# EAGLE design in3peltier (EAGLE 7.1.0)
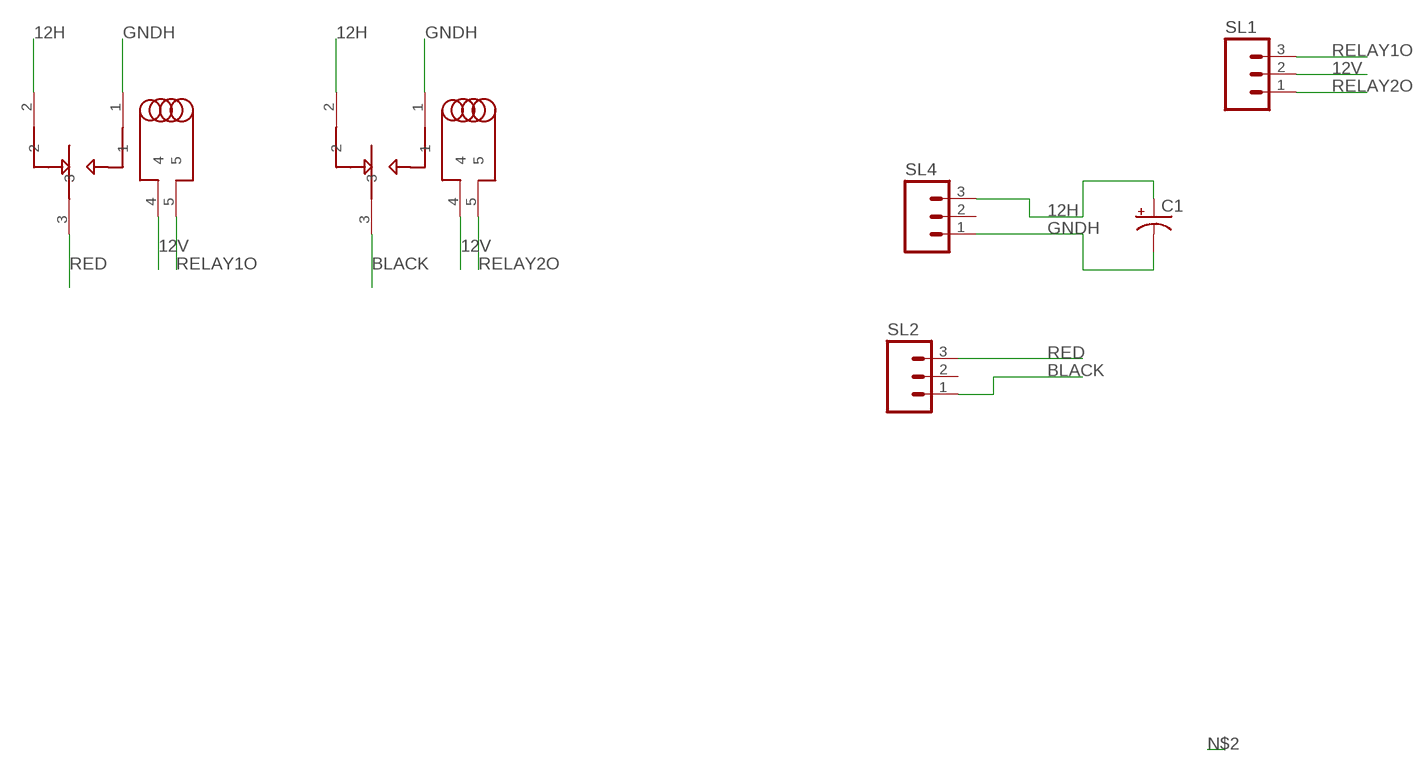
[diagram p0: schematic, sheet 1]

## Parts
C1  CAP_POLPTH2  [CPOL-RADIAL-10UF-25V]
SL1  MA03  [03P]
SL2  MA03  [03P]
SL4  MA03  [03P]
U$1  RELAY-V23092THROUGH_HOLE  [RELAY-V23092]
U$2  RELAY-V23092THROUGH_HOLE  [RELAY-V23092]

## Nets
12H: C1.1(+) SL4.3 U$1.2 U$2.2
12V: SL1.2 U$1.4 U$2.4
BLACK: SL2.1 U$2.3
GNDH: C1.2(-) SL4.1 U$1.1 U$2.1
RED: SL2.3 U$1.3
RELAY1O: SL1.3 U$1.5
RELAY2O: SL1.1 U$2.5
Unconnected: SL2.2 SL4.2

## Library data of the parts
C1 = 01_SparkFun:CAP_POL: Capacitor Polarized These are standard SMD and PTH capacitors. Normally 10uF, 47uF, and 100uF in electrolytic and tantalum varieties. Always verify the external diameter of the through hole cap, it varies with capacity, voltage, and manufacturer. The EIA devices should be standard.
SL1 SL2 SL4 = con-amp-quick:MA03: AMP QUICK CONNECTOR; OC_FARNELL: unknown; OC_NEWARK: unknown
U$1 U$2 = 0001_alejandro:RELAY-V23092

## Board
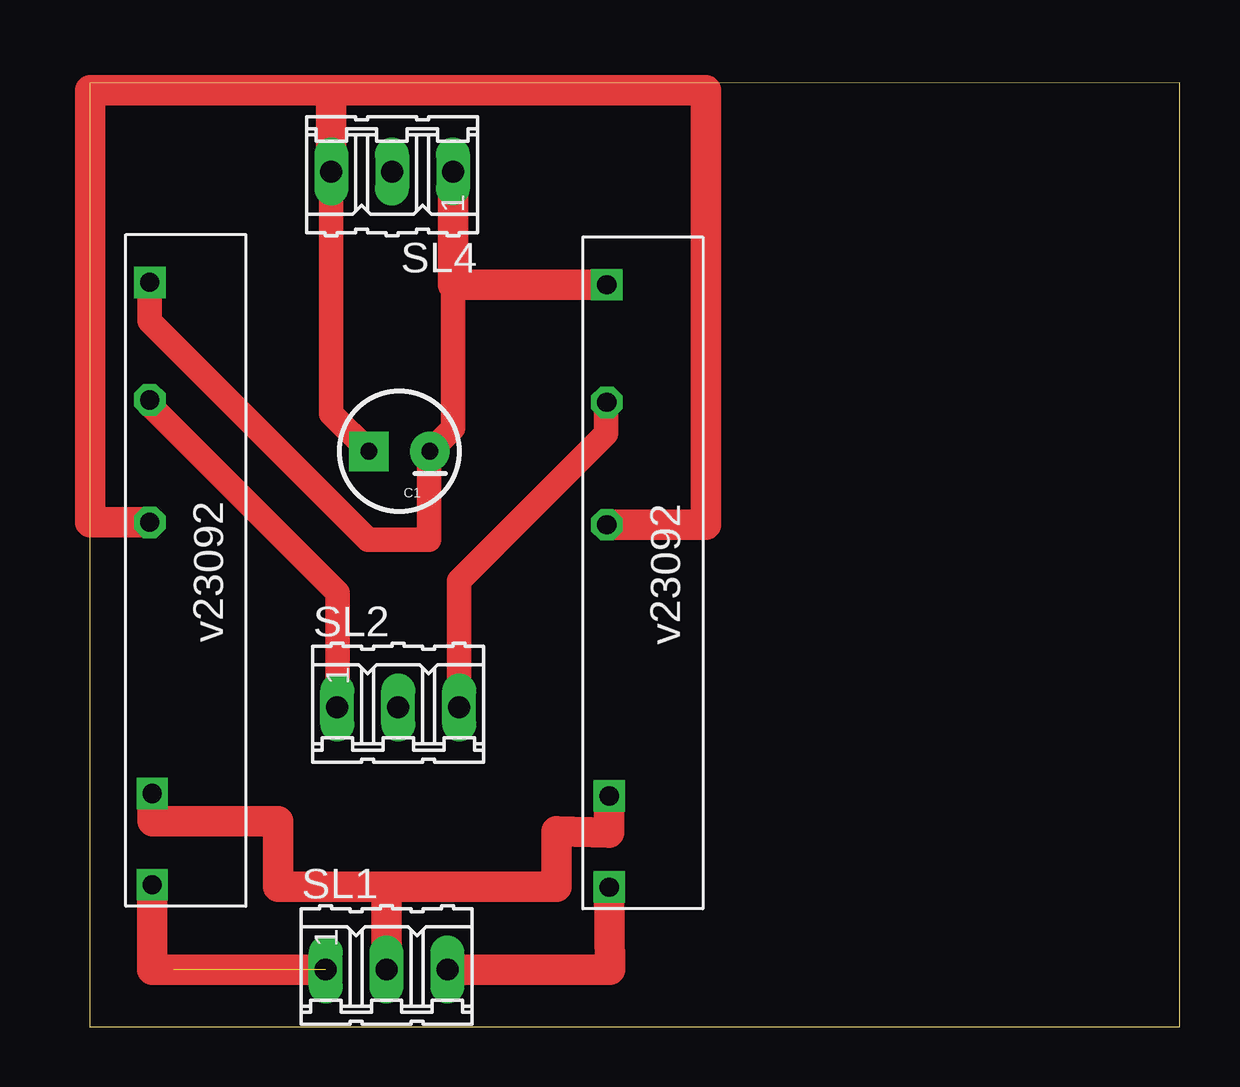
[diagram p1: board, top side]

Size 45.44 x 39.33 mm. Coordinates in mm from the lower left corner, seen from the top.
Outline: 0,0 45.44,0 45.44,39.33 0,39.31 0,0
Copper layers (1*16): Top 0.035mm / dielectric 1.5mm / Bottom 0.035mm
Design rules "default *": minimum track width 14mil, minimum drill 24mil, track to track 15mil, track to pad 15mil, pad to pad 15mil, via to via 15mil, smd to smd 15mil, copper to edge 40mil, drill to drill 8mil, minimum pad ring 10mil, minimum via ring 8mil, stop-mask expansion 4mil, vias tented up to drill 0mil, thermal gap 10mil

### Footprints (pad centres in the part's own frame; a part is rotated, then mirrored left to right if it is on the bottom)
CPOL-RADIAL-10UF-25V = drill 0.7 pad 1.651 square: 1 1.27,0 | drill 0.7 pad 1.651: 2 -1.27,0
03P = drill 0.914 long: 1 -2.54,0; 2 0,0; 3 2.54,0
RELAY-V23092 = drill 0.8 square: 1 2,1; 4 23.3,1.1; 5 27.1,1.1 | drill 0.8 octagon: 2 12,1; 3 6.9,1

### Placement (x,y rotation side)
C1  12.9,23.98 180 top
SL1  12.37,2.39 0 top
SL2  12.85,13.31 0 top
SL4  12.6,35.64 180 top
U$1  20.55,32.92 270 top
U$2  1.5,33.02 270 top

### Tracks (layer width: path | path; a pad name or v marks a point on that pad's centre or on a via)
12H
  Top 1.016: SL4.3 10.06,25.55 C1.1
  Top 1.27: U$1.2 25.68,20.92 25.68,39.01 10.06,39.01 | 10.06,39.01 SL4.3 | U$2.2 0.03,21.02 0.03,39.01 10.06,39.01
12V
  Top 1.27: U$1.4 21.65,8.08 19.46,8.15 19.46,5.84 12.37,5.84 | 12.37,5.84 7.85,5.84 7.85,8.56 2.62,8.56 2.62,9.72 U$2.4 | SL1.2 12.37,5.84
BLACK
  Top 1.016: U$2.3 2.5,25.92 10.34,18.08 10.34,13.33 SL2.1
GNDH
  Top 1.016: 15.14,30.91 15.14,24.94 C1.2 14.15,23.95 14.15,20.29 11.61,20.29 2.5,29.4 U$2.1
  Top 1.27: SL4.1 15.14,30.91 20.05,30.91 U$1.1
RED
  Top 1.016: SL2.3 15.39,18.59 21.51,24.71 21.51,25.98 U$1.3
RELAY1O
  Top 1.27: U$1.5 21.67,2.39 SL1.3
RELAY2O  (1 unrouted)
  Top 1.27: U$2.5 2.6,2.39 SL1.1